# EAGLE schematic flipflop-edgedetect (EAGLE 6.3)
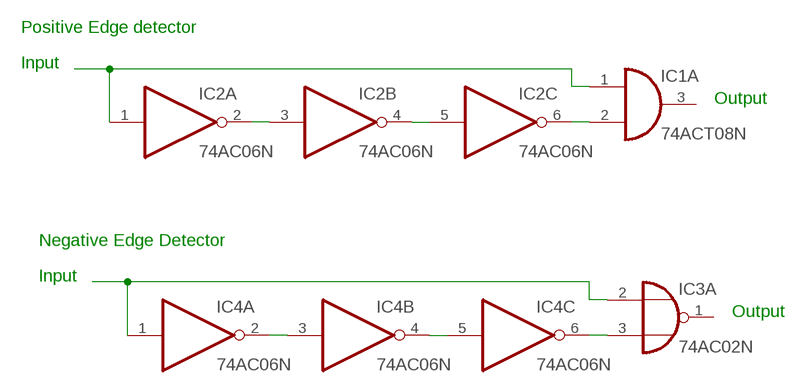
[diagram p0: schematic, sheet 1]

## Parts
IC1  74ACT08N  [DIL14]
IC2  74AC06N  [DIL14]
IC3  74AC02N  [DIL14]
IC4  74AC06N  [DIL14]

## Nets
N$1: IC2.2(A:O) IC2.3(B:I)
N$2: IC2.4(B:O) IC2.5(C:I)
N$3: IC1.2(A:I1) IC2.6(C:O)
N$4: IC1.1(A:I0) IC2.1(A:I)
N$5: IC4.2(A:O) IC4.3(B:I)
N$6: IC4.4(B:O) IC4.5(C:I)
N$7: IC3.3(A:I1) IC4.6(C:O)
N$8: IC3.2(A:I0) IC4.1(A:I)
Unconnected: IC1.3(A:O) IC1.4(B:I0) IC1.5(B:I1) IC1.6(B:O) IC1.8(C:O) IC1.9(C:I0) IC1.10(C:I1) IC1.11(D:O) IC1.12(D:I0) IC1.13(D:I1) IC2.8(D:O) IC2.9(D:I) IC2.10(E:O) IC2.11(E:I) IC2.12(F:O) IC2.13(F:I) IC3.1(A:O) IC3.4(B:O) IC3.5(B:I0) IC3.6(B:I1) IC3.8(C:I0) IC3.9(C:I1) IC3.10(C:O) IC3.11(D:I0) IC3.12(D:I1) IC3.13(D:O) IC4.8(D:O) IC4.9(D:I) IC4.10(E:O) IC4.11(E:I) IC4.12(F:O) IC4.13(F:I)

## Notes on the sheet
- Positive Edge detector
- Input
- Output
- Negative Edge Detector
- Input
- Output

## Power pins joined to a net without a drawn wire
GND: IC1.7(P:GND) IC2.7(P:GND) IC3.7(P:GND) IC4.7(P:GND)
VCC: IC1.14(P:VCC) IC2.14(P:VCC) IC3.14(P:VCC) IC4.14(P:VCC)

## Library data of the parts
IC1 = 74xx-eu:74*08: Quad 2-input AND gate
IC2 IC4 = 74xx-eu:74*06: Hex INVERTER, open collector high-voltage output
IC3 = 74xx-eu:74*02: Quad 2-input NOR gate